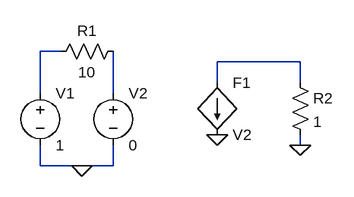
[diagram p0: schematic Draft8.asc]
Draft8.asc, the LTspice schematic file:
Version 4
SHEET 1 880 680
WIRE -48 64 -80 64
WIRE 320 80 192 80
WIRE 192 112 192 80
WIRE 320 112 320 80
WIRE -80 128 -80 64
WIRE 32 128 32 64
WIRE 320 208 320 192
WIRE -80 240 -80 208
WIRE -16 240 -80 240
WIRE 32 240 32 208
WIRE 32 240 -16 240
FLAG 192 192 0
FLAG 320 208 0
FLAG -16 240 0
SYMBOL voltage -80 112 R0
SYMATTR InstName V1
SYMATTR Value 1
SYMBOL res 48 48 R90
WINDOW 0 0 56 VBottom 2
WINDOW 3 32 56 VTop 2
SYMATTR InstName R1
SYMATTR Value 10
SYMBOL res 304 96 R0
SYMATTR InstName R2
SYMATTR Value 1
SYMBOL f 192 112 R0
SYMATTR InstName F1
SYMATTR Value V2
SYMATTR Value2 4
SYMBOL voltage 32 112 R0
SYMATTR InstName V2
SYMATTR Value 0

The netlist it stands for:
* Draft8.asc
V1 N001 0 1
R1 N003 N001 10
R2 N002 0 1
F1 N002 0 V2 4
V2 N003 0 0
.backanno
.end